# Altium schematic sheet IsolatedGPIO.SchDoc
size A4
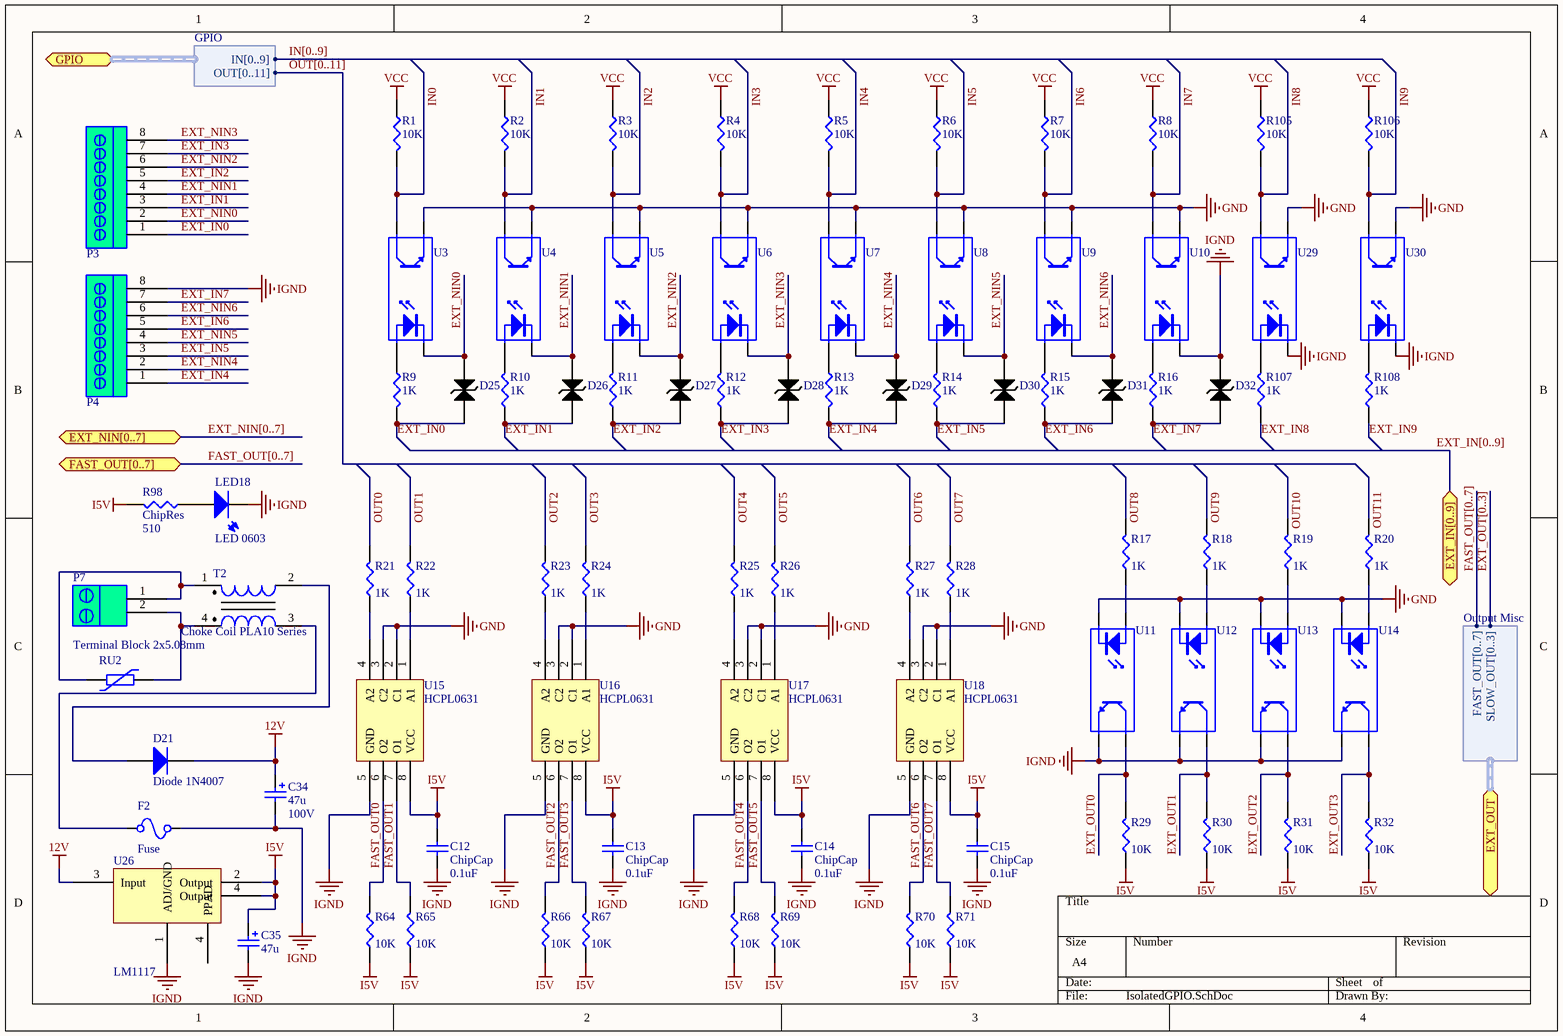
[diagram p0: IsolatedGPIO.SchDoc]

## Parts
C12  ChipCap  value 0.1uF  [CAP0805]
C13  ChipCap  value 0.1uF  [CAP0805]
C14  ChipCap  value 0.1uF  [CAP0805]
C15  ChipCap  value 0.1uF  [CAP0805]
C34  value 47u  Voltage: 100V  [CAPPR5-10x17_1]  (hidden comment: Cap Pol 100/47)
C35  value 47u  [CAPC7343]  (hidden comment: Cap Pol SMD)
D21  Diode 1N4007  [DO-41]
D25  Bidir TVS Diode  [DO-214AS]  (value not drawn)
D26  Bidir TVS Diode  [DO-214AS]  (value not drawn)
D27  Bidir TVS Diode  [DO-214AS]  (value not drawn)
D28  Bidir TVS Diode  [DO-214AS]  (value not drawn)
D29  Bidir TVS Diode  [DO-214AS]  (value not drawn)
D30  Bidir TVS Diode  [DO-214AS]  (value not drawn)
D31  Bidir TVS Diode  [DO-214AS]  (value not drawn)
D32  Bidir TVS Diode  [DO-214AS]  (value not drawn)
F2  Fuse  [PTC1812]
LED18  LED 0603  [PLCC-2]
P3  Terminal Block 8x5.08mm  [SOCKET 8x5.08]  (value not drawn)
P4  Terminal Block 8x5.08mm  [SOCKET 8x5.08]  (value not drawn)
P7  Terminal Block 2x5.08mm  [Socket 2x5.08]
R1  value 10K  [RES0805]  (hidden comment: ChipRes)
R2  value 10K  [RES0805]  (hidden comment: ChipRes)
R3  value 10K  [RES0805]  (hidden comment: ChipRes)
R4  value 10K  [RES0805]  (hidden comment: ChipRes)
R5  value 10K  [RES0805]  (hidden comment: ChipRes)
R6  value 10K  [RES0805]  (hidden comment: ChipRes)
R7  value 10K  [RES0805]  (hidden comment: ChipRes)
R8  value 10K  [RES0805]  (hidden comment: ChipRes)
R9  value 1K  [RES0805]  (hidden comment: ChipRes)
R10  value 1K  [RES0805]  (hidden comment: ChipRes)
R11  value 1K  [RES0805]  (hidden comment: ChipRes)
R12  value 1K  [RES0805]  (hidden comment: ChipRes)
R13  value 1K  [RES0805]  (hidden comment: ChipRes)
R14  value 1K  [RES0805]  (hidden comment: ChipRes)
R15  value 1K  [RES0805]  (hidden comment: ChipRes)
R16  value 1K  [RES0805]  (hidden comment: ChipRes)
R17  value 1K  [RES0805]  (hidden comment: ChipRes)
R18  value 1K  [RES0805]  (hidden comment: ChipRes)
R19  value 1K  [RES0805]  (hidden comment: ChipRes)
R20  value 1K  [RES0805]  (hidden comment: ChipRes)
R21  value 1K  [RES0805]  (hidden comment: ChipRes)
R22  value 1K  [RES0805]  (hidden comment: ChipRes)
R23  value 1K  [RES0805]  (hidden comment: ChipRes)
R24  value 1K  [RES0805]  (hidden comment: ChipRes)
R25  value 1K  [RES0805]  (hidden comment: ChipRes)
R26  value 1K  [RES0805]  (hidden comment: ChipRes)
R27  value 1K  [RES0805]  (hidden comment: ChipRes)
R28  value 1K  [RES0805]  (hidden comment: ChipRes)
R29  value 10K  [RES0805]  (hidden comment: ChipRes)
R30  value 10K  [RES0805]  (hidden comment: ChipRes)
R31  value 10K  [RES0805]  (hidden comment: ChipRes)
R32  value 10K  [RES0805]  (hidden comment: ChipRes)
R64  value 10K  [RES0805]  (hidden comment: ChipRes)
R65  value 10K  [RES0805]  (hidden comment: ChipRes)
R66  value 10K  [RES0805]  (hidden comment: ChipRes)
R67  value 10K  [RES0805]  (hidden comment: ChipRes)
R68  value 10K  [RES0805]  (hidden comment: ChipRes)
R69  value 10K  [RES0805]  (hidden comment: ChipRes)
R70  value 10K  [RES0805]  (hidden comment: ChipRes)
R71  value 10K  [RES0805]  (hidden comment: ChipRes)
R98  ChipRes  value 510  [RES0805]
R105  value 10K  [RES0805]  (hidden comment: ChipRes)
R106  value 10K  [RES0805]  (hidden comment: ChipRes)
R107  value 1K  [RES0805]  (hidden comment: ChipRes)
R108  value 1K  [RES0805]  (hidden comment: ChipRes)
RU2  Varistor S14F25  [S14K25]  (value not drawn)
T2  Choke Coil PLA10 Series  [PLA10]
U3  Optoisolator1  [DIP-4]  (value not drawn)
U4  Optoisolator1  [DIP-4]  (value not drawn)
U5  Optoisolator1  [DIP-4]  (value not drawn)
U6  Optoisolator1  [DIP-4]  (value not drawn)
U7  Optoisolator1  [DIP-4]  (value not drawn)
U8  Optoisolator1  [DIP-4]  (value not drawn)
U9  Optoisolator1  [DIP-4]  (value not drawn)
U10  Optoisolator1  [DIP-4]  (value not drawn)
U11  Optoisolator1  [DIP-4]  (value not drawn)
U12  Optoisolator1  [DIP-4]  (value not drawn)
U13  Optoisolator1  [DIP-4]  (value not drawn)
U14  Optoisolator1  [DIP-4]  (value not drawn)
U15  HCPL0631  [SOIC8]
U16  HCPL0631  [SOIC8]
U17  HCPL0631  [SOIC8]
U18  HCPL0631  [SOIC8]
U26  LM1117  [SOT223-4M]
U29  Optoisolator1  [DIP-4]  (value not drawn)
U30  Optoisolator1  [DIP-4]  (value not drawn)

## Ports
EXT_IN[0..9], EXT_NIN[0..7], EXT_OUT (harness Output Misc), FAST_OUT[0..7], GPIO (harness GPIO)

## Harnesses
GPIO: IN[0..9], OUT[0..11]
Output Misc: FAST_OUT[0..7], SLOW_OUT[0..3]

## Nets
12V: C34.1 D21.2(K) U26.3(Input)
GND: U3.3(E) U4.3(E) U5.3(E) U6.3(E) U7.3(E) U8.3(E) U9.3(E) U10.3(E) U11.2(K) U12.2(K) U13.2(K) U14.2(K) U15.2(C1) U15.3(C2) U16.2(C1) U16.3(C2) U17.2(C1) U17.3(C2) U18.2(C1) U18.3(C2) U29.3(E) U30.3(E)
I5V: C12.2 C13.2 C14.2 C15.2 C35.1 R29.1 R30.1 R31.1 R32.1 R64.1 R65.1 R66.1 R67.1 R68.1 R69.1 R70.1 R71.1 R98.2 U15.8(VCC) U16.8(VCC) U17.8(VCC) U18.8(VCC) U26.2(Output) U26.4(PPAD)
IGND: C12.1 C13.1 C14.1 C15.1 C34.2 C35.2 D32.2 F2.2 LED18.1 P4.8 U10.2(K) U11.3(E) U12.3(E) U13.3(E) U14.3(E) U15.5(GND) U16.5(GND) U17.5(GND) U18.5(GND) U26.1(ADJ/GND) U29.2(K) U30.2(K)
VCC: R1.1 R2.1 R3.1 R4.1 R5.1 R6.1 R7.1 R8.1 R105.1 R106.1
EXT_IN0: D25.1 P3.1 R9.2
EXT_IN1: D26.1 P3.3 R10.1
EXT_IN2: D27.1 P3.5 R11.1
EXT_IN3: D28.1 P3.7 R12.1
EXT_IN4: D29.1 P4.1 R13.2
EXT_IN5: D30.1 P4.3 R14.1
EXT_IN6: D31.1 P4.5 R15.1
EXT_IN7: D32.1 P4.7 R16.1
EXT_IN8: R107.1
EXT_IN9: R108.1
EXT_NIN0: D25.2 P3.2 U3.2(K)
EXT_NIN1: D26.2 P3.4 U4.2(K)
EXT_NIN2: D27.2 P3.6 U5.2(K)
EXT_NIN3: D28.2 P3.8 U6.2(K)
EXT_NIN4: D29.2 P4.2 U7.2(K)
EXT_NIN5: D30.2 P4.4 U8.2(K)
EXT_NIN6: D31.2 P4.6 U9.2(K)
EXT_OUT0: R29.2 U11.4(C)
EXT_OUT1: R30.2 U12.4(C)
EXT_OUT2: R31.2 U13.4(C)
EXT_OUT3: R32.2 U14.4(C)
FAST_OUT0: R64.2 U15.6(O2)
FAST_OUT1: R65.2 U15.7(O1)
FAST_OUT2: R66.2 U16.6(O2)
FAST_OUT3: R67.2 U16.7(O1)
FAST_OUT4: R68.2 U17.6(O2)
FAST_OUT5: R69.2 U17.7(O1)
FAST_OUT6: R70.2 U18.6(O2)
FAST_OUT7: R71.2 U18.7(O1)
IN0: R1.2 U3.4(C)
IN1: R2.2 U4.4(C)
IN2: R3.2 U5.4(C)
IN3: R4.2 U6.4(C)
IN4: R5.2 U7.4(C)
IN5: R6.2 U8.4(C)
IN6: R7.2 U9.4(C)
IN7: R8.2 U10.4(C)
IN8: R105.2 U29.4(C)
IN9: R106.2 U30.4(C)
OUT0: R21.2
OUT1: R22.2
OUT2: R23.2
OUT3: R24.2
OUT4: R25.2
OUT5: R26.2
OUT6: R27.2
OUT7: R28.2
OUT8: R17.2
OUT9: R18.2
OUT10: R19.2
OUT11: R20.2
NetD21_1: D21.1(A) T2.2
NetF2_1: F2.1 T2.3
NetLED18_2: LED18.2 R98.1
NetP7_1: P7.1 RU2.1 T2.1
NetP7_2: P7.2 RU2.2 T2.4
NetR9_1: R9.1 U3.1(A)
NetR10_2: R10.2 U4.1(A)
NetR11_2: R11.2 U5.1(A)
NetR12_2: R12.2 U6.1(A)
NetR13_1: R13.1 U7.1(A)
NetR14_2: R14.2 U8.1(A)
NetR15_2: R15.2 U9.1(A)
NetR16_2: R16.2 U10.1(A)
NetR17_1: R17.1 U11.1(A)
NetR18_1: R18.1 U12.1(A)
NetR19_1: R19.1 U13.1(A)
NetR20_1: R20.1 U14.1(A)
NetR21_1: R21.1 U15.4(A2)
NetR22_1: R22.1 U15.1(A1)
NetR23_1: R23.1 U16.4(A2)
NetR24_1: R24.1 U16.1(A1)
NetR25_1: R25.1 U17.4(A2)
NetR26_1: R26.1 U17.1(A1)
NetR27_1: R27.1 U18.4(A2)
NetR28_1: R28.1 U18.1(A1)
NetR107_2: R107.2 U29.1(A)
NetR108_2: R108.2 U30.1(A)

## Buses and harness runs
bus EXT_IN[0..9] = port EXT_IN[0..9]
bus EXT_NIN[0..7] = port EXT_NIN[0..7]
bus EXT_OUT[0..3]
bus FAST_OUT[0..7]
bus FAST_OUT[0..7] = port FAST_OUT[0..7]
bus IN[0..9]
bus OUT[0..11]

## Library data of the parts
C12-C15 = ChipCap: Capacitor; Published: 8-Jun-2000; LatestRevisionDate: 17-Jul-2002; LatestRevisionNote: Re-released for DXP Platform.; PackageReference: RAD-0.3; Publisher: Altium Limited
C34 = Cap Pol 100/47: Polarized Capacitor (Radial); Supplier 1: Digi-Key; Supplier Part Number 1: P1284-ND
C35 = Cap Pol Chip: Polarized Capacitor (Radial); Supplier 1: Digi-Key; Supplier Part Number 1: 399-4029-1-ND
D21 = Diode 1N4007: 1 Amp General Purpose Rectifier; Published: 8-Jun-2000; LatestRevisionDate: 17-Jul-2002; LatestRevisionNote: Re-released for DXP Platform.; DatasheetVersion: 1998; PackageVersion: Aug-1999; PackageReference: DO-41; Publisher: Altium Limited; PackageDescription: Diode, Axial; Body 5.2 x 2.7 mm (LxDia. max), Lead Dia. 0.86 mm (max); Code_JEDEC: DO-204-AL; ComponentLink1Description: Manufacturer Link; ComponentLink1URL: http://www.fairchildsemi.com/; ComponentLink2Description: Datasheet; ComponentLink2URL: http://www.fairchildsemi.com/ds/1N%2F1N4001.pdf
D25-D32 = TVS Bidir Diode SMA
F2 = Fuse PTC1812: Fuse PTC 1812 Thermoresistor
LED18 = LED0603
P3 P4 = Socket_8x5.08_RA_2Wall: Terminal Block Socket Right Angle 8x5.08mm 2-Wall
P7 = Socket_2x5.08_RA_2Wall: Terminal Block Socket Right Angle 2x5.08mm 2 Wall
R1-R32 R64-R71 R98 R105-R108 = ChipRes: Chip resistor
RU2 = Varistor S14K25: varistor
T2 = Choke Coil: Common Mode Rejection Choke Coil LA10 Series
U3-U14 U29 U30 = Optoisolator1: 4-Pin Phototransistor Optocoupler; Published: 24-Mar-1999; LatestRevisionDate: 04-Mar-2005; LatestRevisionNote: Sch pins 3 & 4 Swapped.; DatasheetVersion: Nov-2003; PackageReference: DIP-4; Publisher: Altium Limited
U15-U18 = HCPL0631: 2-channel opto-coupler
U26 = LM1117: Power Mgt Voltage Regulator